# Altium schematic sheet Charge Interface.SchDoc
size A4; SheetNumber: 3; SheetTotal: 10
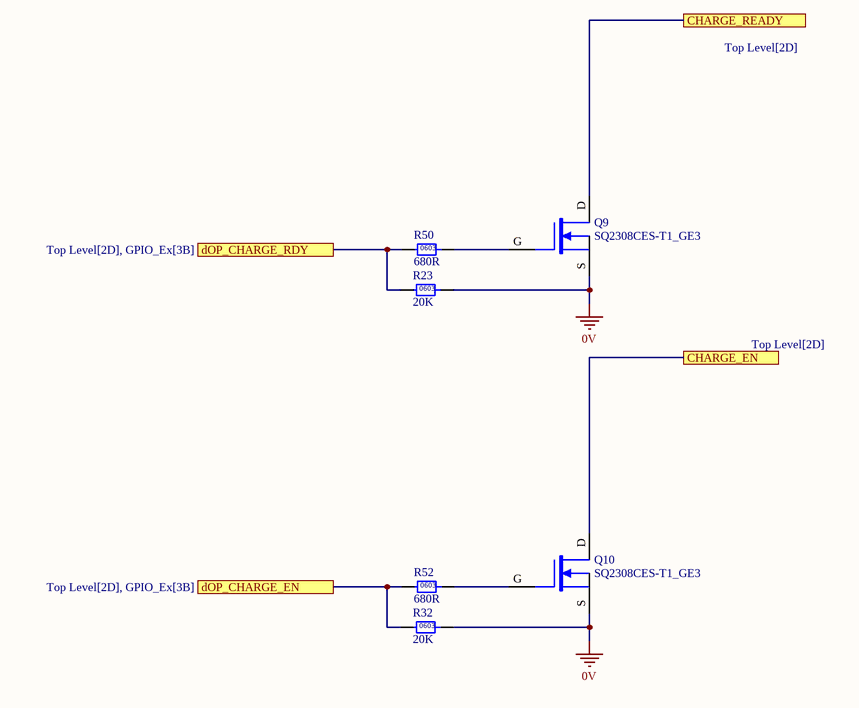
[diagram p0: Charge Interface.SchDoc]

## Parts
Q9  SQ2308CES-T1_GE3  [VSHY SOT-23-3]
Q10  SQ2308CES-T1_GE3  [VSHY SOT-23-3]
R23  20K  [0603]
R32  20K  [0603]
R50  680R  [0603]
R52  680R  [0603]

## Ports
CHARGE_EN (see Top Level[2D]), CHARGE_READY (see Top Level[2D]), dOP_CHARGE_EN (see Top Level[2D], GPIO_Ex[3B]), dOP_CHARGE_RDY (see Top Level[2D], GPIO_Ex[3B])

## Nets
0V: Q9.S Q10.S R23.2 R32.2
CHARGE_EN: Q10.D ; port CHARGE_EN
CHARGE_READY: Q9.D ; port CHARGE_READY
dOP_CHARGE_EN: R32.1 R52.1 ; port dOP_CHARGE_EN
dOP_CHARGE_RDY: R23.1 R50.1 ; port dOP_CHARGE_RDY
NetQ9_G: Q9.G R50.2
NetQ10_G: Q10.G R52.2

## Notes on the sheet
- Section Leader Check:
- Date:
- Title:
- Revision
- Variant
- Project:
- Engineers:
- Sheet
- of
- (in symbol RC0603FR-0720KL) 0603
- (in symbol RC0603JR-13680RL) 0603

## Library data of the parts
Q9 Q10 = SQ2308CES-T1_GE3: MOSFET N-CH 60V 2.3A SOT23; Manufacturer: Vishay Siliconix; Type: N-channel; Rated Power: 2W; Published: 24-Mar-1999; LatestRevisionDate: 29-May-2009; LatestRevisionNote: IPC-7351 Footprint Added.; PackageVersion: Sep-2000; PackageReference: SOT-343; Publisher: Altium Limited; PackageDescription: 4-Pin SOT-343 Package 1.3 mm Pitch, 2.1 mm Lead Span; Part Number: SQ2308CES-T1_GE3; Digikey Part Number: SQ2308CES-T1_GE3CT-ND
R23 R32 = RC0603FR-0720KL: Manufacturer: YAGEO; Tolerance: 0.01; Rated Power: 0.1W; Part Number: RC0603FR-0720KL; Value: 20K; Material: FR-07; Digikey Part Number: 311-20.0KHRCT-ND
R50 R52 = RC0603JR-13680RL: Manufacturer: YAGEO; Tolerance: 0.01; Rated Power: 0.1W; Part Number: RC0603JR-13680RL; Value: 680R; Material: FR-07; Digikey Part Number: 13-RC0603JR-13680RLCT-ND